# EAGLE design Cooler (EAGLE 7.4.0)
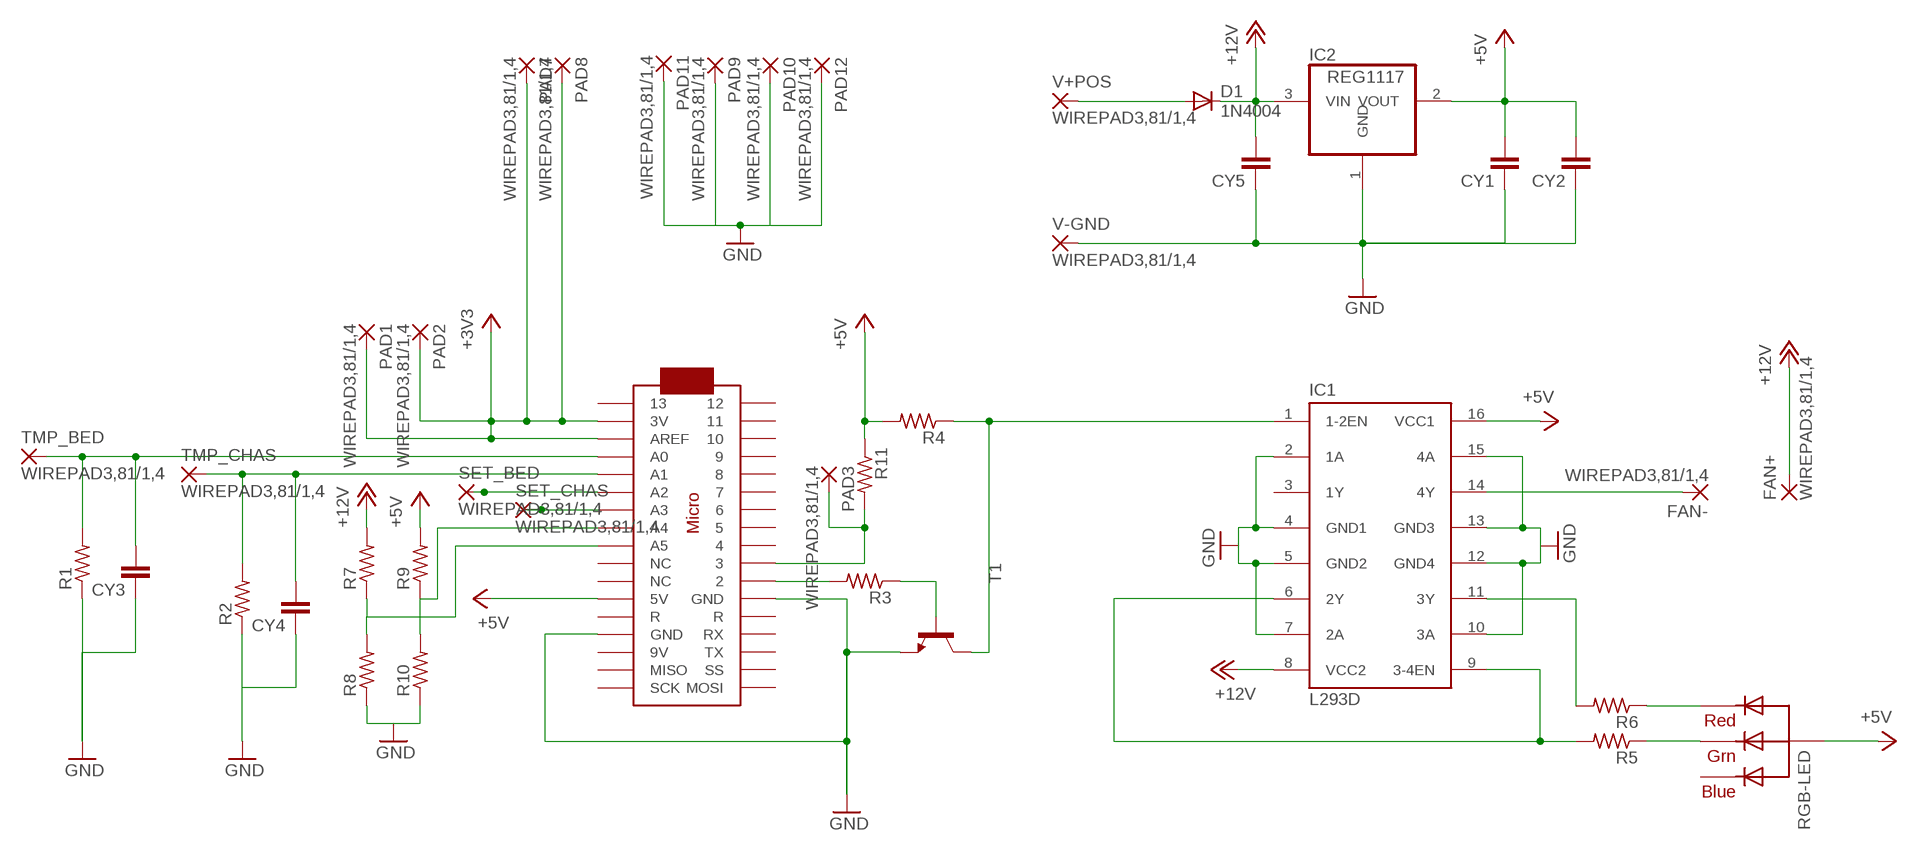
[diagram p0: schematic, sheet 1]

## Parts
CY1  CYYC7B5  [YC7B5]
CY2  CYYC7B5  [YC7B5]
CY3  CYYC7B5  [YC7B5]
CY4  CYYC7B5  [YC7B5]
CY5  CYYC7B5  [YC7B5]
D1  1N4004  [DO41-10]
FAN+  WIREPAD3,81/1,4  [3,81/1,4]
FAN-  WIREPAD3,81/1,4  [3,81/1,4]
IC1  L293D  [DIL16]
IC2  REG1117  [SOT223]
PAD1  WIREPAD3,81/1,4  [3,81/1,4]
PAD2  WIREPAD3,81/1,4  [3,81/1,4]
PAD3  WIREPAD3,81/1,4  [3,81/1,4]
PAD7  WIREPAD3,81/1,4  [3,81/1,4]
PAD8  WIREPAD3,81/1,4  [3,81/1,4]
PAD9  WIREPAD3,81/1,4  [3,81/1,4]
PAD10  WIREPAD3,81/1,4  [3,81/1,4]
PAD11  WIREPAD3,81/1,4  [3,81/1,4]
PAD12  WIREPAD3,81/1,4  [3,81/1,4]
R1  R-US_0309/10  [0309/10]
R2  R-US_0309/10  [0309/10]
R3  R-US_0309/10  [0309/10]
R4  R-US_0309/10  [0309/10]
R5  R-US_0309/12  [0309/12]
R6  R-US_0309/12  [0309/12]
R7  R-US_0309/12  [0309/12]
R8  R-US_0309/10  [0309/10]
R9  R-US_0309/12  [0309/12]
R10  R-US_0309/10  [0309/10]
R11  R-US_0309/10  [0309/10]
RGB-LED  RGBLED_CA-5MM  [LED5MMRGB]
SET_BED  WIREPAD3,81/1,4  [3,81/1,4]
SET_CHAS  WIREPAD3,81/1,4  [3,81/1,4]
T1  2N2222-NPN-TO92-EBC  [TO92-EBC]
TMP_BED  WIREPAD3,81/1,4  [3,81/1,4]
TMP_CHAS  WIREPAD3,81/1,4  [3,81/1,4]
U$1  ARDUINOMICRO  [ARDUINOMICRO]
V+POS  WIREPAD3,81/1,4  [3,81/1,4]
V-GND  WIREPAD3,81/1,4  [3,81/1,4]

## Nets
+3V3: PAD1.1(P) PAD2.1(P) PAD7.1(P) PAD8.1(P) U$1.P$32(AREF) U$1.P$33(3V)
+5V: CY1.2 CY2.2 IC1.16(VCC1) IC2.2(VOUT) R4.2 R9.2 R11.1 RGB-LED.2(VCC) U$1.P$23(5V)
+12V: CY5.2 D1.C FAN+.1(P) IC1.8(VCC2) IC2.3(VIN) R7.2
GND: CY1.1 CY2.1 CY3.1 CY4.1 CY5.1 IC1.2(1A) IC1.4(GND1) IC1.5(GND2) IC1.7(2A) IC1.10(3A) IC1.12(GND4) IC1.13(GND3) IC1.15(4A) IC2.1(GND) PAD9.1(P) PAD10.1(P) PAD11.1(P) PAD12.1(P) R1.1 R2.1 R8.1 R10.1 T1.E U$1.P$12(GND) U$1.P$21(GND) V-GND.1(P)
N$3: R3.1 T1.B
N$4: CY3.2 R1.2 TMP_BED.1(P) U$1.P$31(A0)
N$5: IC1.1(1-2EN) R4.1 T1.C
N$6: CY4.2 R2.2 TMP_CHAS.1(P) U$1.P$30(A1)
N$7: IC1.6(2Y) IC1.9(3-4EN) R5.2
N$8: IC1.11(3Y) R6.2
N$9: R6.1 RGB-LED.1(RED)
N$10: R5.1 RGB-LED.3(GREEN)
N$11: FAN-.1(P) IC1.14(4Y)
N$13: D1.A V+POS.1(P)
N$14: R3.2 U$1.P$11
N$19: PAD3.1(P) R11.2 U$1.P$10
N$23: SET_BED.1(P) U$1.P$29(A2)
N$24: SET_CHAS.1(P) U$1.P$28(A3)
N$25: R7.1 R8.2 U$1.P$26(A5)
N$26: R9.1 R10.2 U$1.P$27(A4)
Unconnected: IC1.3(1Y) RGB-LED.4(BLUE) U$1.P$1 U$1.P$2 U$1.P$3 U$1.P$4 U$1.P$5 U$1.P$6 U$1.P$7 U$1.P$8 U$1.P$9 U$1.P$13(R) U$1.P$14(RX) U$1.P$15(TX) U$1.P$16(SS) U$1.P$17(MOSI) U$1.P$18(SCK) U$1.P$19(MISO) U$1.P$20(9V) U$1.P$22(R) U$1.P$24(NC) U$1.P$25(NC) U$1.P$34

## Library data of the parts
CY1-CY5 = resistor:CY: Y CAPACITOR for power line
D1 = adafruit:1N4004: DIODE General purpose 1N400x type rectifier (With bigger pads) http://www.ladyada.net/library/pcb/eaglelibrary.html
FAN+ FAN- PAD1-PAD3 PAD7-PAD12 SET_BED SET_CHAS TMP_BED TMP_CHAS V+POS V-GND = wirepad:WIREPAD: Wire PAD connect wire on PCB
IC1 = st-microelectronics:L293D: PUSH-PULL 4 CHANNEL DRIVER; MPN: L293D; OC_FARNELL: 9589619; OC_NEWARK: 56P8249
IC2 = burr-brown:REG1117: 800mA and 1A Low Dropout (LDO) Positive Regulator 1.8V, 2.5V, 2.85V, 3.3V, 5V, and Adj; MPN: REG1117; OC_FARNELL: 1097566; OC_NEWARK: 14P6981
R1-R11 = adafruit:R-US_: RESISTOR, American symbol
RGB-LED = adafruit:RGBLED_CA: RGB LED, common-anode 5MM Staggered pins 5mm Piranha package http://www.ladyada.net/library/pcb/eaglelibrary.html
T1 = transistor-neu-to92:*-NPN-: NPN Transistror
U$1 = adafruit:ARDUINOMICRO

## Net classes
0 default: width 1.397 mm, drill 0.254 mm, clearance 0.762 mm

## Board
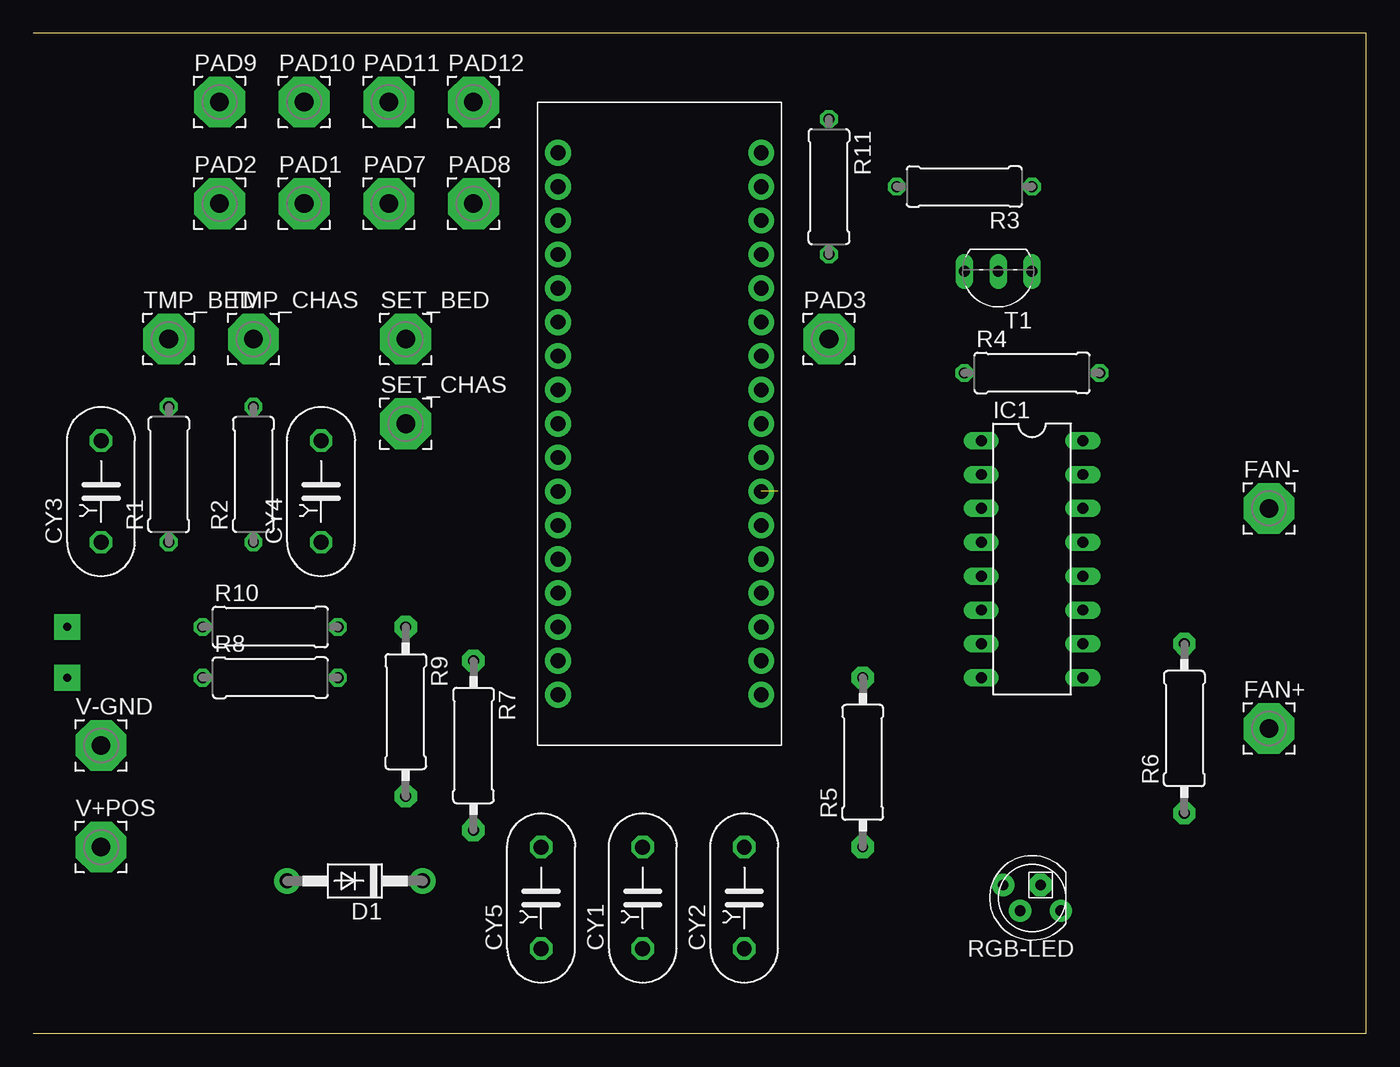
[diagram p1: board, top side]
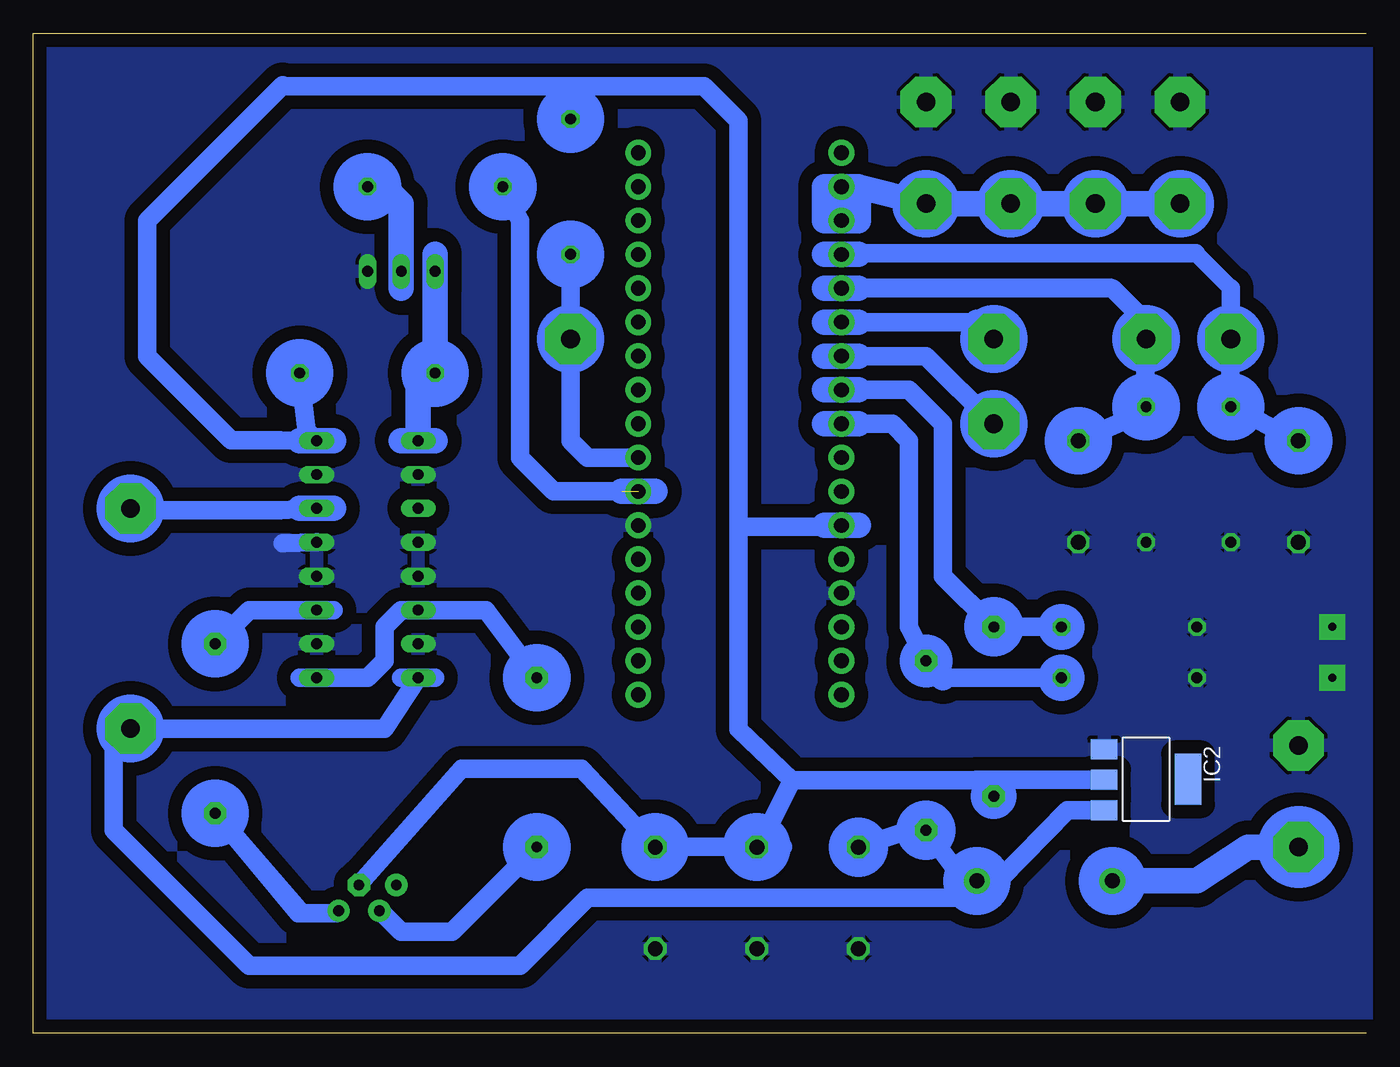
[diagram p2: board, bottom side, seen from below]

Size 100 x 75 mm. Coordinates in mm from the lower left corner, seen from the top.
Outline: 0,0 100,0 100,75 0,75
Copper layers (1*16): Top 0.035mm / dielectric 1.5mm / Bottom 0.035mm
Design rules "default": minimum track width 10mil, minimum drill 24mil, track to track 8mil, track to pad 8mil, pad to pad 8mil, via to via 8mil, smd to smd 8mil, copper to edge 40mil, drill to drill 8mil, minimum pad ring 10mil, minimum via ring 8mil, stop-mask expansion 4mil, vias tented up to drill 0mil, thermal gap 10mil

### Footprints (pad centres in the part's own frame; a part is rotated, then mirrored left to right if it is on the bottom)
YC7B5 = drill 1.118 octagon: 1 -3.81,0; 2 3.81,0
DO41-10 = drill 1.118 pad 1.93: A 5.08,0; C -5.08,0
3,81/1,4 = drill 1.397 pad 3.81 octagon: 1 0,0
DIL16 = drill 0.813 long: 1 -8.89,-3.81; 2 -6.35,-3.81; 3 -3.81,-3.81; 4 -1.27,-3.81; 5 1.27,-3.81; 6 3.81,-3.81; 7 6.35,-3.81; 8 8.89,-3.81; 9 8.89,3.81; 10 6.35,3.81; 11 3.81,3.81; 12 1.27,3.81; 13 -1.27,3.81; 14 -3.81,3.81; 15 -6.35,3.81; 16 -8.89,3.81
SOT223 = smd 1.499 x 2.007: 1 -2.261,-3.15; 2 0.025,-3.15; 3 2.311,-3.15 | smd 3.81 x 2.007: 4 0,3.15
0309/10 = drill 0.813 octagon: 1 -5.08,0; 2 5.08,0
0309/12 = drill 0.813 pad 1.676 octagon: 1 -6.35,0; 2 6.35,0
LED5MMRGB = drill 0.8 pad 1.676: 1 -2.159,0.968; 3 0.889,0.968; 4 2.159,-0.968 | drill 0.8 pad 1.676 octagon: 2 -0.635,-0.968
TO92-EBC = drill 0.813 long: B 0,-1.27; C 2.54,-1.27; E -2.54,-1.27
ARDUINOMICRO = drill 1.1 pad 1.93: P$1 -20.32,7.62; P$2 -17.78,7.62; P$3 -15.24,7.62; P$4 -12.7,7.62; P$5 -10.16,7.62; P$6 -7.62,7.62; P$7 -5.08,7.62; P$8 -2.54,7.62; P$9 0,7.62; P$10 2.54,7.62; P$11 5.08,7.62; P$12 12.7,-7.62; P$13 10.16,-7.62; P$14 12.7,7.62; P$15 15.24,7.62; P$16 17.78,7.62; P$17 20.32,7.62; P$18 20.32,-7.62; P$19 17.78,-7.62; P$20 15.24,-7.62; P$21 7.62,7.62; P$22 10.16,7.62; P$23 7.62,-7.62; P$24 5.08,-7.62; P$25 2.54,-7.62; P$26 0,-7.62; P$27 -2.54,-7.62; P$28 -5.08,-7.62; P$29 -7.62,-7.62; P$30 -10.16,-7.62; P$31 -12.7,-7.62; P$32 -15.24,-7.62; P$33 -17.78,-7.62; P$34 -20.32,-7.62

### Placement (x,y rotation side)
CY1  45.72,10.16 90 top
CY2  53.34,10.16 90 top
CY3  5.08,40.64 90 top
CY4  21.59,40.64 90 top
CY5  38.1,10.16 90 top
D1  24.13,11.43 180 top
FAN+  92.71,22.86 0 top
FAN-  92.71,39.37 0 top
IC1  74.93,35.56 270 top
IC2  16.51,19.05 270 bottom
PAD1  20.32,62.23 0 top
PAD2  13.97,62.23 0 top
PAD3  59.69,52.07 0 top
PAD7  26.67,62.23 0 top
PAD8  33.02,62.23 0 top
PAD9  13.97,69.85 0 top
PAD10  20.32,69.85 0 top
PAD11  26.67,69.85 0 top
PAD12  33.02,69.85 0 top
R1  10.16,41.91 90 top
R2  16.51,41.91 90 top
R3  69.85,63.5 180 top
R4  74.93,49.53 0 top
R5  62.23,20.32 90 top
R6  86.36,22.86 90 top
R7  33.02,21.59 270 top
R8  17.78,26.67 0 top
R9  27.94,24.13 270 top
R10  17.78,30.48 0 top
R11  59.69,63.5 270 top
RGB-LED  74.93,10.16 180 top
SET_BED  27.94,52.07 0 top
SET_CHAS  27.94,45.72 0 top
T1  72.39,55.88 180 top
TMP_BED  10.16,52.07 0 top
TMP_CHAS  16.51,52.07 0 top
U$1  46.99,45.72 270 top
V+POS  5.08,13.97 0 top
V-GND  5.08,21.59 0 top

### Tracks (layer width: path | path; a pad name or v marks a point on that pad's centre or on a via)
+3V3
  Bottom 1.397: U$1.P$32 39.5,61 39.5,63.5 U$1.P$33
  Bottom 1.93: PAD2.1 PAD1.1 PAD7.1 PAD8.1 38.1,63.5 | 38.1,63.5 U$1.P$33 40.64,63.5 40.64,60.96 38.1,60.96 38.1,63.5
+5V
  Bottom 1.397: 43.08,19 47.08,22.81 47.08,38 | 43.08,19 29.16,19 R9.2 29.23,19.02 IC2.2 | 45.54,14 43.08,19 | 45.54,14 CY1.2 43.75,14 45.54,14 | 45.54,14 50.75,14 CY2.2 58.87,19.85 67.88,19.85 75.5,11.25 RGB-LED.2 | 38.25,38 39.25,38 | 40,38 39.25,38 | 39.25,38 U$1.P$23 40,38 | 47.08,38 47.08,68.43 49.69,71.04 58.42,71.04 | 40,38 47.08,38 | 58.42,71.04 81.2,71.04 81.28,71.12 91.44,60.96 91.44,50.8 85.14,44.5 81.5,44.5 IC1.16 79.5,45.21 R4.2 | R11.1 59.69,69.77 58.42,71.04
+12V
  Bottom 1.397: IC2.3 22.42,16.74 27.5,11.54 29,11.54 D1.C 30.48,10.16 | 30.48,10.16 58.42,10.16 63.5,5.08 83.82,5.08 93.98,15.24 93.98,22.86 FAN+.1 73.66,22.86 IC1.8 | 30.48,10.16 29.21,10.16 R7.2 34.29,15.24 CY5.2
GND  (via drill 0.6 pad 1.93)
  Bottom 1.397: IC1.13 81.25,36.75 81.28,36.75
  other vias: 2.54,30.48 2.54,26.67
  pour Bottom (isolate 1.016): 0,74.93 100.33,74.93 100.33,0 0,0
N$1
  Bottom 1.93: 38.1,58.42 40.64,58.42
N$2
  Bottom 1.397: 69.85,26.67 72.39,26.67
N$3
  Bottom 1.93: R3.1 73.66,63.5 72.39,62.23 72.39,58.42 T1.B 72.39,55.88
N$4
  Bottom 1.27: 12.78,58.5 10.16,55.88
  Bottom 1.397: TMP_BED.1 10.19,51.96 10.19,49.75 R1.2 9.69,46.46 10.31,47.08 CY3.2 | U$1.P$31 39.25,58.5 12.78,58.5 | TMP_BED.1 10.69,52.46 10.16,51.93 TMP_BED.1 | 10.16,55.88 TMP_BED.1
N$5
  Bottom 1.93: IC1.1 71.12,48.26 R4.1 69.85,55.88 T1.C 69.85,58.42
N$6
  Bottom 1.397: TMP_CHAS.1 16.65,51.96 16.65,52.29 R2.2 16.9,46.46 21.36,44.54 CY4.2
  Bottom 1.422: 16.65,51.96 16.4,53.23 19.05,55.88 38.1,55.88 U$1.P$30
  Bottom 1.93: 38.1,55.88 40.64,55.88
N$7
  Bottom 1.397: R5.2 66.04,31.75 IC1.6 72.39,31.75 73.66,30.48 73.66,27.94 74.93,26.67 77.47,26.67 IC1.9 80.01,26.67
N$8
  Bottom 1.397: R6.2 83.82,31.75 80.01,31.75 IC1.11 77.47,31.75
N$9
  Bottom 1.397: 79.88,9 R6.1 80.12,9 79.88,9 | RGB-LED.1 77.25,9 79.88,9
N$10
  Bottom 1.397: RGB-LED.3 74.04,9.27 72.39,7.62 68.58,7.62 R5.1
N$11
  Bottom 1.397: IC1.14 81.5,39.25 91.42,39.25 FAN-.1
N$12
  Bottom 1.93: 38.1,38.1 40.64,38.1
N$13
  Bottom 1.93: V+POS.1 8.89,13.97 12.7,11.43 D1.A
N$14  (1 unrouted)
  Bottom 1.397: 55.88,40.64 60.96,40.64 63.5,43.18 63.5,60.96 R3.2
  Bottom 1.93: 53.34,40.64 55.88,40.64
N$16
  Bottom 1.93: 69.85,44.45 72.39,44.45
N$17
  Bottom 1.93: 17.78,11.43 20.32,11.43
N$18
  Bottom 1.93: 27.94,11.43 30.48,11.43
N$19
  Bottom 1.397: U$1.P$10 58.42,43.18 59.69,44.45 PAD3.1 R11.2
N$21
  Bottom 1.93: 77.47,39.37 80.01,39.37
N$22
  Bottom 1.93: 77.47,44.45 80.01,44.45
N$23
  Bottom 1.397: 38.1,53.34 29.21,53.34
  Bottom 1.93: 29.21,53.34 SET_BED.1 | 38.1,53.34 U$1.P$29 40.64,53.34
N$24
  Bottom 1.397: U$1.P$28 38.1,50.8 33.02,50.8 SET_CHAS.1
  Bottom 1.93: 40.64,50.8 U$1.P$28 38.1,50.8
N$25
  Bottom 1.397: R7.1 34.29,30.48 34.29,44.45 35.56,45.72 38.1,45.72 U$1.P$26 | R8.2 31.75,26.67
  Bottom 1.93: 40.64,45.72 U$1.P$26 38.1,45.72 | 31.75,26.67 R7.1
N$26
  Bottom 1.397: R10.2 R9.1 31.75,34.29 31.75,45.72 34.29,48.26 38.1,48.26 U$1.P$27
  Bottom 1.93: 40.64,48.26 U$1.P$27 38.1,48.26
(copper drawn outside any net)
  shapes: Bottom circle x37